# Altium project PROC154E3_SCH.PrjPcb (part 20 of 60)
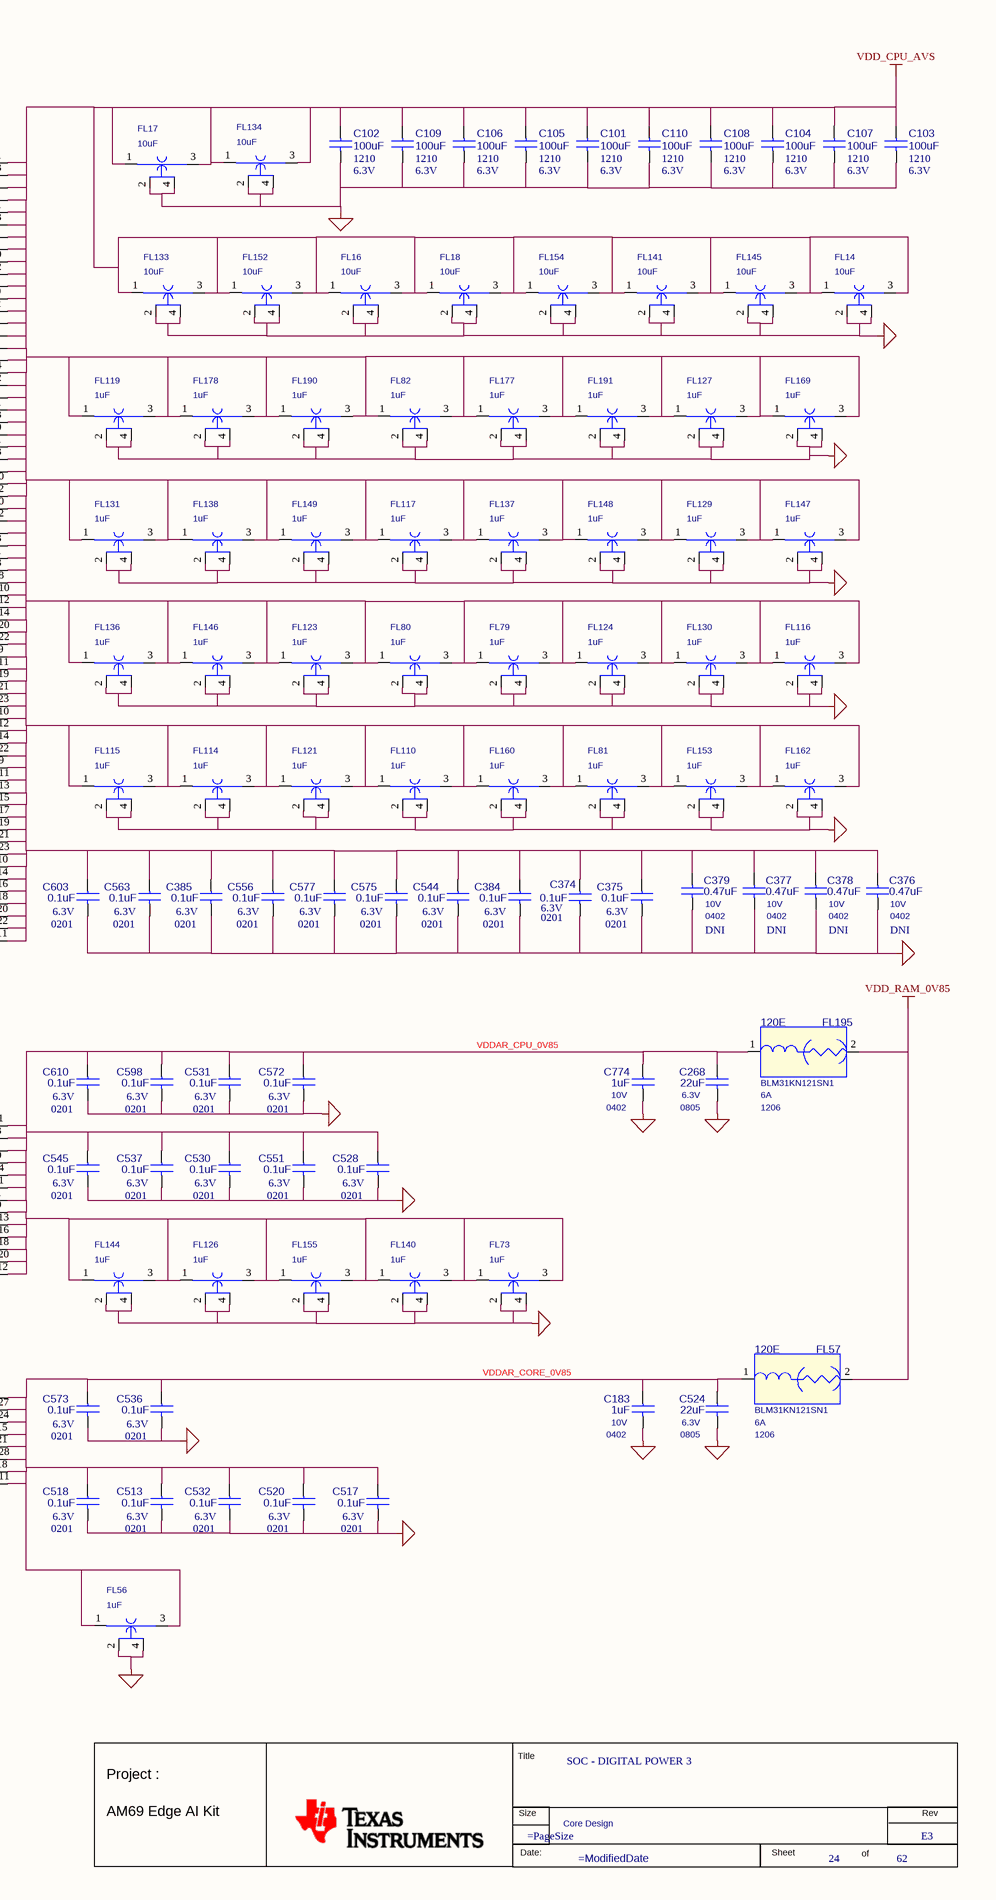
[diagram p107: 24. SOC DIGITAL POWER 3.SchDoc, right]

## Sheet 24. SOC DIGITAL POWER 3.SchDoc: SOC - DIGITAL POWER 3 (continued)
### Library data of the parts
*#24 = MISTRAL_TITLEBLK_CSIZE_1: Issue: 1.0; Project: PROC154E2(001)_SK_AM69; Name: PROC154E2 001 SK AM69; Page Create Date: March  8, 1995; Page Size: =PageSize; Page Modify Date: =ModifiedDate; Schematic Page Count: 62; Schematic Page Number: 24
C97 = CAP_Dup1: CAP CERAMIC 100uF 2.5V 20% X7T 1210; Part Reference: C97; Manufacturer: MURATA; Mistral Part No: 120009080004-R; Mfr_part_number: GCM32ED70E107ME36; Part_type: CAPACITORS\CERAMIC; Direct Alternate_mfr_name: TDK; Direct Alternate_mfr_part_number: CGA6P1X7S1A476M; Project: ALL_DATA_NANO_SOM; Wattage: NA; Customs_HS_Code: 85322990; Custom_Duty: 15%; Value: 100uF; Footprint Ref: CAP1210_2-75; Mfr_name: MURATA; Tolerance: 20%; Distributor_name: DIGIKEY; Distributor_part_number: 490-3390-1-ND; Library Ref: CAP; Height: 2.70MM; Weight: 110mg; Temperature: -55°C+85°C; Datasheet: Y:\MIS_DATABASE\DATASHEETS\CAPACITORS\MURATA-GXX-SER_NOV17.PDF; Crtd /date: MANIRAJA/291216; Chkd/date: VASANTHA/291216; MECHANICAL 3D STEP FILE: CAP1210_2-75; Library Path: Y:\MIS_DATABASE\Library\ALTIUM_TOOL\SCHEMATICS_PARTS\MS_DISCRETE_Library.schlib; Footprint Path: Y:\MIS_DATABASE\Library\ALTIUM_TOOL\PCB_FOOTPRINTS\Altium_Footprint_Lib.PcbLib; Automotive Alternate_mfr_name: TDK; Automotive Alternate_mfr_part_number: CGA6P1X7S1A476M; PCB Footprint: CAP1210_2-75
C99 = CAP_Dup1: CAP CERAMIC 100uF 2.5V 20% X7T 1210; Part Reference: C99; Manufacturer: MURATA; Mistral Part No: 120009080004-R; Mfr_part_number: GCM32ED70E107ME36; Part_type: CAPACITORS\CERAMIC; Direct Alternate_mfr_name: TDK; Direct Alternate_mfr_part_number: CGA6P1X7S1A476M; Project: ALL_DATA_NANO_SOM; Wattage: NA; Customs_HS_Code: 85322990; Custom_Duty: 15%; Value: 100uF; PCB Footprint: CAP1210_2-75; Footprint Ref: CAP1210_2-75; Mfr_name: MURATA; Tolerance: 20%; Distributor_name: DIGIKEY; Distributor_part_number: 490-3390-1-ND; Library Ref: CAP; Height: 2.70MM; Weight: 110mg; Temperature: -55°C+85°C; Datasheet: Y:\MIS_DATABASE\DATASHEETS\CAPACITORS\MURATA-GXX-SER_NOV17.PDF; Crtd /date: MANIRAJA/291216; Chkd/date: VASANTHA/291216; MECHANICAL 3D STEP FILE: CAP1210_2-75; Library Path: Y:\MIS_DATABASE\Library\ALTIUM_TOOL\SCHEMATICS_PARTS\MS_DISCRETE_Library.schlib; Footprint Path: Y:\MIS_DATABASE\Library\ALTIUM_TOOL\PCB_FOOTPRINTS\Altium_Footprint_Lib.PcbLib; Automotive Alternate_mfr_name: TDK; Automotive Alternate_mfr_part_number: CGA6P1X7S1A476M
C101 = CAP_Dup1: CAP CERAMIC 100uF 2.5V 20% X7T 1210; Part Reference: C101; Manufacturer: MURATA; Mistral Part No: 120009080004-R; Mfr_part_number: GCM32ED70E107ME36; Part_type: CAPACITORS\CERAMIC; Direct Alternate_mfr_name: TDK; Direct Alternate_mfr_part_number: CGA6P1X7S1A476M; Project: ALL_DATA_NANO_SOM; Wattage: NA; Customs_HS_Code: 85322990; Custom_Duty: 15%; Value: 100uF; PCB Footprint: CAP1210_2-75; Footprint Ref: CAP1210_2-75; Mfr_name: MURATA; Tolerance: 20%; Distributor_name: DIGIKEY; Distributor_part_number: 490-3390-1-ND; Library Ref: CAP; Height: 2.70MM; Weight: 110mg; Temperature: -55°C+85°C; Datasheet: Y:\MIS_DATABASE\DATASHEETS\CAPACITORS\MURATA-GXX-SER_NOV17.PDF; Crtd /date: MANIRAJA/291216; Chkd/date: VASANTHA/291216; MECHANICAL 3D STEP FILE: CAP1210_2-75; Library Path: Y:\MIS_DATABASE\Library\ALTIUM_TOOL\SCHEMATICS_PARTS\MS_DISCRETE_Library.schlib; Footprint Path: Y:\MIS_DATABASE\Library\ALTIUM_TOOL\PCB_FOOTPRINTS\Altium_Footprint_Lib.PcbLib; Automotive Alternate_mfr_name: TDK; Automotive Alternate_mfr_part_number: CGA6P1X7S1A476M
C102 = CAP_Dup1: CAP CERAMIC 100uF 2.5V 20% X7T 1210; Part Reference: C102; Manufacturer: MURATA; Mistral Part No: 120009080004-R; Mfr_part_number: GCM32ED70E107ME36; Part_type: CAPACITORS\CERAMIC; Direct Alternate_mfr_name: TDK; Direct Alternate_mfr_part_number: CGA6P1X7S1A476M; Project: ALL_DATA_NANO_SOM; Wattage: NA; Customs_HS_Code: 85322990; Custom_Duty: 15%; Value: 100uF; PCB Footprint: CAP1210_2-75; Footprint Ref: CAP1210_2-75; Mfr_name: MURATA; Tolerance: 20%; Distributor_name: DIGIKEY; Distributor_part_number: 490-3390-1-ND; Library Ref: CAP; Height: 2.70MM; Weight: 110mg; Temperature: -55°C+85°C; Datasheet: Y:\MIS_DATABASE\DATASHEETS\CAPACITORS\MURATA-GXX-SER_NOV17.PDF; Crtd /date: MANIRAJA/291216; Chkd/date: VASANTHA/291216; MECHANICAL 3D STEP FILE: CAP1210_2-75; Library Path: Y:\MIS_DATABASE\Library\ALTIUM_TOOL\SCHEMATICS_PARTS\MS_DISCRETE_Library.schlib; Footprint Path: Y:\MIS_DATABASE\Library\ALTIUM_TOOL\PCB_FOOTPRINTS\Altium_Footprint_Lib.PcbLib; Automotive Alternate_mfr_name: TDK; Automotive Alternate_mfr_part_number: CGA6P1X7S1A476M
C103 = CAP_Dup1: CAP CERAMIC 100uF 2.5V 20% X7T 1210; Part Reference: C103; Manufacturer: MURATA; Mistral Part No: 120009080004-R; Mfr_part_number: GCM32ED70E107ME36; Part_type: CAPACITORS\CERAMIC; Direct Alternate_mfr_name: TDK; Direct Alternate_mfr_part_number: CGA6P1X7S1A476M; Project: ALL_DATA_NANO_SOM; Wattage: NA; Customs_HS_Code: 85322990; Custom_Duty: 15%; Value: 100uF; PCB Footprint: CAP1210_2-75; Footprint Ref: CAP1210_2-75; Mfr_name: MURATA; Tolerance: 20%; Distributor_name: DIGIKEY; Distributor_part_number: 490-3390-1-ND; Library Ref: CAP; Height: 2.70MM; Weight: 110mg; Temperature: -55°C+85°C; Datasheet: Y:\MIS_DATABASE\DATASHEETS\CAPACITORS\MURATA-GXX-SER_NOV17.PDF; Crtd /date: MANIRAJA/291216; Chkd/date: VASANTHA/291216; MECHANICAL 3D STEP FILE: CAP1210_2-75; Library Path: Y:\MIS_DATABASE\Library\ALTIUM_TOOL\SCHEMATICS_PARTS\MS_DISCRETE_Library.schlib; Footprint Path: Y:\MIS_DATABASE\Library\ALTIUM_TOOL\PCB_FOOTPRINTS\Altium_Footprint_Lib.PcbLib; Automotive Alternate_mfr_name: TDK; Automotive Alternate_mfr_part_number: CGA6P1X7S1A476M
C104 = CAP_Dup1: CAP CERAMIC 100uF 2.5V 20% X7T 1210; Part Reference: C104; Manufacturer: MURATA; Mistral Part No: 120009080004-R; Mfr_part_number: GCM32ED70E107ME36; Part_type: CAPACITORS\CERAMIC; Direct Alternate_mfr_name: TDK; Direct Alternate_mfr_part_number: CGA6P1X7S1A476M; Project: ALL_DATA_NANO_SOM; Wattage: NA; Customs_HS_Code: 85322990; Custom_Duty: 15%; Value: 100uF; PCB Footprint: CAP1210_2-75; Footprint Ref: CAP1210_2-75; Mfr_name: MURATA; Tolerance: 20%; Distributor_name: DIGIKEY; Distributor_part_number: 490-3390-1-ND; Library Ref: CAP; Height: 2.70MM; Weight: 110mg; Temperature: -55°C+85°C; Datasheet: Y:\MIS_DATABASE\DATASHEETS\CAPACITORS\MURATA-GXX-SER_NOV17.PDF; Crtd /date: MANIRAJA/291216; Chkd/date: VASANTHA/291216; MECHANICAL 3D STEP FILE: CAP1210_2-75; Library Path: Y:\MIS_DATABASE\Library\ALTIUM_TOOL\SCHEMATICS_PARTS\MS_DISCRETE_Library.schlib; Footprint Path: Y:\MIS_DATABASE\Library\ALTIUM_TOOL\PCB_FOOTPRINTS\Altium_Footprint_Lib.PcbLib; Automotive Alternate_mfr_name: TDK; Automotive Alternate_mfr_part_number: CGA6P1X7S1A476M
C105 = CAP_Dup1: CAP CERAMIC 100uF 2.5V 20% X7T 1210; Part Reference: C105; Manufacturer: MURATA; Mistral Part No: 120009080004-R; Mfr_part_number: GCM32ED70E107ME36; Part_type: CAPACITORS\CERAMIC; Direct Alternate_mfr_name: TDK; Direct Alternate_mfr_part_number: CGA6P1X7S1A476M; Project: ALL_DATA_NANO_SOM; Wattage: NA; Customs_HS_Code: 85322990; Custom_Duty: 15%; Value: 100uF; PCB Footprint: CAP1210_2-75; Footprint Ref: CAP1210_2-75; Mfr_name: MURATA; Tolerance: 20%; Distributor_name: DIGIKEY; Distributor_part_number: 490-3390-1-ND; Library Ref: CAP; Height: 2.70MM; Weight: 110mg; Temperature: -55°C+85°C; Datasheet: Y:\MIS_DATABASE\DATASHEETS\CAPACITORS\MURATA-GXX-SER_NOV17.PDF; Crtd /date: MANIRAJA/291216; Chkd/date: VASANTHA/291216; MECHANICAL 3D STEP FILE: CAP1210_2-75; Library Path: Y:\MIS_DATABASE\Library\ALTIUM_TOOL\SCHEMATICS_PARTS\MS_DISCRETE_Library.schlib; Footprint Path: Y:\MIS_DATABASE\Library\ALTIUM_TOOL\PCB_FOOTPRINTS\Altium_Footprint_Lib.PcbLib; Automotive Alternate_mfr_name: TDK; Automotive Alternate_mfr_part_number: CGA6P1X7S1A476M
C106 = CAP_Dup1: CAP CERAMIC 100uF 2.5V 20% X7T 1210; Part Reference: C106; Manufacturer: MURATA; Mistral Part No: 120009080004-R; Mfr_part_number: GCM32ED70E107ME36; Part_type: CAPACITORS\CERAMIC; Direct Alternate_mfr_name: TDK; Direct Alternate_mfr_part_number: CGA6P1X7S1A476M; Project: ALL_DATA_NANO_SOM; Wattage: NA; Customs_HS_Code: 85322990; Custom_Duty: 15%; Value: 100uF; PCB Footprint: CAP1210_2-75; Footprint Ref: CAP1210_2-75; Mfr_name: MURATA; Tolerance: 20%; Distributor_name: DIGIKEY; Distributor_part_number: 490-3390-1-ND; Library Ref: CAP; Height: 2.70MM; Weight: 110mg; Temperature: -55°C+85°C; Datasheet: Y:\MIS_DATABASE\DATASHEETS\CAPACITORS\MURATA-GXX-SER_NOV17.PDF; Crtd /date: MANIRAJA/291216; Chkd/date: VASANTHA/291216; MECHANICAL 3D STEP FILE: CAP1210_2-75; Library Path: Y:\MIS_DATABASE\Library\ALTIUM_TOOL\SCHEMATICS_PARTS\MS_DISCRETE_Library.schlib; Footprint Path: Y:\MIS_DATABASE\Library\ALTIUM_TOOL\PCB_FOOTPRINTS\Altium_Footprint_Lib.PcbLib; Automotive Alternate_mfr_name: TDK; Automotive Alternate_mfr_part_number: CGA6P1X7S1A476M
C107 = CAP_Dup1: CAP CERAMIC 100uF 2.5V 20% X7T 1210; Part Reference: C107; Manufacturer: MURATA; Mistral Part No: 120009080004-R; Mfr_part_number: GCM32ED70E107ME36; Part_type: CAPACITORS\CERAMIC; Direct Alternate_mfr_name: TDK; Direct Alternate_mfr_part_number: CGA6P1X7S1A476M; Project: ALL_DATA_NANO_SOM; Wattage: NA; Customs_HS_Code: 85322990; Custom_Duty: 15%; Value: 100uF; PCB Footprint: CAP1210_2-75; Footprint Ref: CAP1210_2-75; Mfr_name: MURATA; Tolerance: 20%; Distributor_name: DIGIKEY; Distributor_part_number: 490-3390-1-ND; Library Ref: CAP; Height: 2.70MM; Weight: 110mg; Temperature: -55°C+85°C; Datasheet: Y:\MIS_DATABASE\DATASHEETS\CAPACITORS\MURATA-GXX-SER_NOV17.PDF; Crtd /date: MANIRAJA/291216; Chkd/date: VASANTHA/291216; MECHANICAL 3D STEP FILE: CAP1210_2-75; Library Path: Y:\MIS_DATABASE\Library\ALTIUM_TOOL\SCHEMATICS_PARTS\MS_DISCRETE_Library.schlib; Footprint Path: Y:\MIS_DATABASE\Library\ALTIUM_TOOL\PCB_FOOTPRINTS\Altium_Footprint_Lib.PcbLib; Automotive Alternate_mfr_name: TDK; Automotive Alternate_mfr_part_number: CGA6P1X7S1A476M
C108 = CAP_Dup1: CAP CERAMIC 100uF 2.5V 20% X7T 1210; Part Reference: C108; Manufacturer: MURATA; Mistral Part No: 120009080004-R; Mfr_part_number: GCM32ED70E107ME36; Part_type: CAPACITORS\CERAMIC; Direct Alternate_mfr_name: TDK; Direct Alternate_mfr_part_number: CGA6P1X7S1A476M; Project: ALL_DATA_NANO_SOM; Wattage: NA; Customs_HS_Code: 85322990; Custom_Duty: 15%; Value: 100uF; PCB Footprint: CAP1210_2-75; Footprint Ref: CAP1210_2-75; Mfr_name: MURATA; Tolerance: 20%; Distributor_name: DIGIKEY; Distributor_part_number: 490-3390-1-ND; Library Ref: CAP; Height: 2.70MM; Weight: 110mg; Temperature: -55°C+85°C; Datasheet: Y:\MIS_DATABASE\DATASHEETS\CAPACITORS\MURATA-GXX-SER_NOV17.PDF; Crtd /date: MANIRAJA/291216; Chkd/date: VASANTHA/291216; MECHANICAL 3D STEP FILE: CAP1210_2-75; Library Path: Y:\MIS_DATABASE\Library\ALTIUM_TOOL\SCHEMATICS_PARTS\MS_DISCRETE_Library.schlib; Footprint Path: Y:\MIS_DATABASE\Library\ALTIUM_TOOL\PCB_FOOTPRINTS\Altium_Footprint_Lib.PcbLib; Automotive Alternate_mfr_name: TDK; Automotive Alternate_mfr_part_number: CGA6P1X7S1A476M
C109 = CAP_Dup1: CAP CERAMIC 100uF 2.5V 20% X7T 1210; Part Reference: C109; Manufacturer: MURATA; Mistral Part No: 120009080004-R; Mfr_part_number: GCM32ED70E107ME36; Part_type: CAPACITORS\CERAMIC; Direct Alternate_mfr_name: TDK; Direct Alternate_mfr_part_number: CGA6P1X7S1A476M; Project: ALL_DATA_NANO_SOM; Wattage: NA; Customs_HS_Code: 85322990; Custom_Duty: 15%; Value: 100uF; PCB Footprint: CAP1210_2-75; Footprint Ref: CAP1210_2-75; Mfr_name: MURATA; Tolerance: 20%; Distributor_name: DIGIKEY; Distributor_part_number: 490-3390-1-ND; Library Ref: CAP; Height: 2.70MM; Weight: 110mg; Temperature: -55°C+85°C; Datasheet: Y:\MIS_DATABASE\DATASHEETS\CAPACITORS\MURATA-GXX-SER_NOV17.PDF; Crtd /date: MANIRAJA/291216; Chkd/date: VASANTHA/291216; MECHANICAL 3D STEP FILE: CAP1210_2-75; Library Path: Y:\MIS_DATABASE\Library\ALTIUM_TOOL\SCHEMATICS_PARTS\MS_DISCRETE_Library.schlib; Footprint Path: Y:\MIS_DATABASE\Library\ALTIUM_TOOL\PCB_FOOTPRINTS\Altium_Footprint_Lib.PcbLib; Automotive Alternate_mfr_name: TDK; Automotive Alternate_mfr_part_number: CGA6P1X7S1A476M
C110 = CAP_Dup1: CAP CERAMIC 100uF 2.5V 20% X7T 1210; Part Reference: C110; Manufacturer: MURATA; Mistral Part No: 120009080004-R; Mfr_part_number: GCM32ED70E107ME36; Part_type: CAPACITORS\CERAMIC; Direct Alternate_mfr_name: TDK; Direct Alternate_mfr_part_number: CGA6P1X7S1A476M; Project: ALL_DATA_NANO_SOM; Wattage: NA; Customs_HS_Code: 85322990; Custom_Duty: 15%; Value: 100uF; PCB Footprint: CAP1210_2-75; Footprint Ref: CAP1210_2-75; Mfr_name: MURATA; Tolerance: 20%; Distributor_name: DIGIKEY; Distributor_part_number: 490-3390-1-ND; Library Ref: CAP; Height: 2.70MM; Weight: 110mg; Temperature: -55°C+85°C; Datasheet: Y:\MIS_DATABASE\DATASHEETS\CAPACITORS\MURATA-GXX-SER_NOV17.PDF; Crtd /date: MANIRAJA/291216; Chkd/date: VASANTHA/291216; MECHANICAL 3D STEP FILE: CAP1210_2-75; Library Path: Y:\MIS_DATABASE\Library\ALTIUM_TOOL\SCHEMATICS_PARTS\MS_DISCRETE_Library.schlib; Footprint Path: Y:\MIS_DATABASE\Library\ALTIUM_TOOL\PCB_FOOTPRINTS\Altium_Footprint_Lib.PcbLib; Automotive Alternate_mfr_name: TDK; Automotive Alternate_mfr_part_number: CGA6P1X7S1A476M
C114 = CAP_Dup1: CAP CERAMIC 100uF 2.5V 20% X7T 1210; Part Reference: C114; Manufacturer: MURATA; Mistral Part No: 120009080004-R; Mfr_part_number: GCM32ED70E107ME36; Part_type: CAPACITORS\CERAMIC; Direct Alternate_mfr_name: TDK; Direct Alternate_mfr_part_number: CGA6P1X7S1A476M; Project: ALL_DATA_NANO_SOM; Wattage: NA; Customs_HS_Code: 85322990; Custom_Duty: 15%; Value: 100uF; PCB Footprint: CAP1210_2-75; Footprint Ref: CAP1210_2-75; Mfr_name: MURATA; Tolerance: 20%; Distributor_name: DIGIKEY; Distributor_part_number: 490-3390-1-ND; Library Ref: CAP; Height: 2.70MM; Weight: 110mg; Temperature: -55°C+85°C; Datasheet: Y:\MIS_DATABASE\DATASHEETS\CAPACITORS\MURATA-GXX-SER_NOV17.PDF; Crtd /date: MANIRAJA/291216; Chkd/date: VASANTHA/291216; MECHANICAL 3D STEP FILE: CAP1210_2-75; Library Path: Y:\MIS_DATABASE\Library\ALTIUM_TOOL\SCHEMATICS_PARTS\MS_DISCRETE_Library.schlib; Footprint Path: Y:\MIS_DATABASE\Library\ALTIUM_TOOL\PCB_FOOTPRINTS\Altium_Footprint_Lib.PcbLib; Automotive Alternate_mfr_name: TDK; Automotive Alternate_mfr_part_number: CGA6P1X7S1A476M
C132 = CAP_Dup1: CAP CERAMIC 100uF 2.5V 20% X7T 1210; Part Reference: C132; Manufacturer: MURATA; Mistral Part No: 120009080004-R; Mfr_part_number: GCM32ED70E107ME36; Part_type: CAPACITORS\CERAMIC; Direct Alternate_mfr_name: TDK; Direct Alternate_mfr_part_number: CGA6P1X7S1A476M; Project: ALL_DATA_NANO_SOM; Wattage: NA; Customs_HS_Code: 85322990; Custom_Duty: 15%; Value: 100uF; PCB Footprint: CAP1210_2-75; Footprint Ref: CAP1210_2-75; Mfr_name: MURATA; Tolerance: 20%; Distributor_name: DIGIKEY; Distributor_part_number: 490-3390-1-ND; Library Ref: CAP; Height: 2.70MM; Weight: 110mg; Temperature: -55°C+85°C; Datasheet: Y:\MIS_DATABASE\DATASHEETS\CAPACITORS\MURATA-GXX-SER_NOV17.PDF; Crtd /date: MANIRAJA/291216; Chkd/date: VASANTHA/291216; MECHANICAL 3D STEP FILE: CAP1210_2-75; Library Path: Y:\MIS_DATABASE\Library\ALTIUM_TOOL\SCHEMATICS_PARTS\MS_DISCRETE_Library.schlib; Footprint Path: Y:\MIS_DATABASE\Library\ALTIUM_TOOL\PCB_FOOTPRINTS\Altium_Footprint_Lib.PcbLib; Automotive Alternate_mfr_name: TDK; Automotive Alternate_mfr_part_number: CGA6P1X7S1A476M
C145 = CAP_Dup1: CAP CERAMIC 100uF 2.5V 20% X7T 1210; Part Reference: C145; Manufacturer: MURATA; Mistral Part No: 120009080004-R; Mfr_part_number: GCM32ED70E107ME36; Part_type: CAPACITORS\CERAMIC; Direct Alternate_mfr_name: TDK; Direct Alternate_mfr_part_number: CGA6P1X7S1A476M; Project: ALL_DATA_NANO_SOM; Wattage: NA; Customs_HS_Code: 85322990; Custom_Duty: 15%; Value: 100uF; PCB Footprint: CAP1210_2-75; Footprint Ref: CAP1210_2-75; Mfr_name: MURATA; Tolerance: 20%; Distributor_name: DIGIKEY; Distributor_part_number: 490-3390-1-ND; Library Ref: CAP; Height: 2.70MM; Weight: 110mg; Temperature: -55°C+85°C; Datasheet: Y:\MIS_DATABASE\DATASHEETS\CAPACITORS\MURATA-GXX-SER_NOV17.PDF; Crtd /date: MANIRAJA/291216; Chkd/date: VASANTHA/291216; MECHANICAL 3D STEP FILE: CAP1210_2-75; Library Path: Y:\MIS_DATABASE\Library\ALTIUM_TOOL\SCHEMATICS_PARTS\MS_DISCRETE_Library.schlib; Footprint Path: Y:\MIS_DATABASE\Library\ALTIUM_TOOL\PCB_FOOTPRINTS\Altium_Footprint_Lib.PcbLib; Automotive Alternate_mfr_name: TDK; Automotive Alternate_mfr_part_number: CGA6P1X7S1A476M
C151 = CAP_Dup1: CAP CERAMIC 100uF 2.5V 20% X7T 1210; Part Reference: C151; Automotive Alternate_mfr_part_number: CGA6P1X7S1A476M; Automotive Alternate_mfr_name: TDK; Part_type: CAPACITORS\CERAMIC; Mfr_part_number: GCM32ED70E107ME36; Mfr_name: MURATA; Mistral Part No: 120009080004-R; Custom_Duty: 15%; Customs_HS_Code: 85322990; Wattage: NA; Project: ALL_DATA_NANO_SOM; Value: 100uF; Direct Alternate_mfr_part_number: CGA6P1X7S1A476M; Direct Alternate_mfr_name: TDK; Footprint Path: Y:\MIS_DATABASE\Library\ALTIUM_TOOL\PCB_FOOTPRINTS\Altium_Footprint_Lib.PcbLib; Library Path: Y:\MIS_DATABASE\Library\ALTIUM_TOOL\SCHEMATICS_PARTS\MS_DISCRETE_Library.schlib; MECHANICAL 3D STEP FILE: CAP1210_2-75; Chkd/date: VASANTHA/291216; Crtd /date: MANIRAJA/291216; Datasheet: Y:\MIS_DATABASE\DATASHEETS\CAPACITORS\MURATA-GXX-SER_NOV17.PDF; Temperature: -55°C+85°C; Weight: 110mg; Height: 2.70MM; Library Ref: CAP; Distributor_part_number: 490-3390-1-ND; Distributor_name: DIGIKEY; Tolerance: 20%; Footprint Ref: CAP1210_2-75; Manufacturer: MURATA; PCB Footprint: CAP1210_2-75
C170 = CAP_Dup1: CAP CERAMIC 0.1uF 6.3V 10% X7S AUTO 0201; Part Reference: C170; Manufacturer: MURATA; Part_type: CAPACITORS\CERAMIC; Mfr_part_number: GCM033C70J104KE02D; Mistral Part No: 120018100001-R; Custom_Duty: 15%; Customs_HS_Code: 85322990; Wattage: NA; Project: TI_J7_SVB-DUT; Value: 0.1uF; PCB Footprint: CAP0201_0-5; Footprint Path: Y:\MIS_DATABASE\Library\ALTIUM_TOOL\PCB_FOOTPRINTS\Altium_Footprint_Lib.PcbLib; Library Path: Y:\MIS_DATABASE\Library\ALTIUM_TOOL\SCHEMATICS_PARTS\MS_DISCRETE_Library.schlib; MECHANICAL 3D STEP FILE: CAP0201_0-5; Chkd/date: MANIRAJA/011018; Crtd /date: MANIRAJA/011018; Datasheet: Y:\MIS_DATABASE\DATASHEETS\CAPACITORS\MURATA-GCM-SER.PDF; Temperature: -55°C+125°C; Weight: NA; Height: 0.33MM; Library Ref: CAP; Distributor_part_number: NA; Distributor_name: NA; Tolerance: 10%; Mfr_name: MURATA; Footprint Ref: CAP0201_0-5
C171 = CAP_Dup1: CAP CERAMIC 0.1uF 6.3V 10% X7S AUTO 0201; Part Reference: C171; Manufacturer: MURATA; Mistral Part No: 120018100001-R; Mfr_part_number: GCM033C70J104KE02D; Part_type: CAPACITORS\CERAMIC; Project: TI_J7_SVB-DUT; Wattage: NA; Customs_HS_Code: 85322990; Custom_Duty: 15%; Value: 0.1uF; PCB Footprint: CAP0201_0-5; Footprint Ref: CAP0201_0-5; Mfr_name: MURATA; Tolerance: 10%; Distributor_name: NA; Distributor_part_number: NA; Library Ref: CAP; Height: 0.33MM; Weight: NA; Temperature: -55°C+125°C; Datasheet: Y:\MIS_DATABASE\DATASHEETS\CAPACITORS\MURATA-GCM-SER.PDF; Crtd /date: MANIRAJA/011018; Chkd/date: MANIRAJA/011018; MECHANICAL 3D STEP FILE: CAP0201_0-5; Library Path: Y:\MIS_DATABASE\Library\ALTIUM_TOOL\SCHEMATICS_PARTS\MS_DISCRETE_Library.schlib; Footprint Path: Y:\MIS_DATABASE\Library\ALTIUM_TOOL\PCB_FOOTPRINTS\Altium_Footprint_Lib.PcbLib
C183 = CAP_Dup1: CAP CERAMIC 1uF 10V 10% X7S AUTO 0402; Part Reference: C183; Manufacturer: MURATA; Part_type: CAPACITORS\CERAMIC; Mfr_part_number: GCM155C71A105KE38D; Mistral Part No: 120018090021-R; Custom_Duty: 15%; Customs_HS_Code: 85322990; Wattage: NA; Project: SMART-M_SCRIPTALK_PB; Value: 1uF; PCB Footprint: CAP0402_0-75; Footprint Path: Y:\MIS_DATABASE\Library\ALTIUM_TOOL\PCB_FOOTPRINTS\Altium_Footprint_Lib.PcbLib; Library Path: Y:\MIS_DATABASE\Library\ALTIUM_TOOL\SCHEMATICS_PARTS\MS_DISCRETE_Library.schlib; MECHANICAL 3D STEP FILE: CAP0402_0-75; Chkd/date: MANIRAJA/100918; Crtd /date: ALVY/100918; Datasheet: Y:\MIS_DATABASE\DATASHEETS\CAPACITORS\MURATA-GCM-SER.PDF; Temperature: -55°C+125°C; Weight: 6mg; Height: 0.70MM; Library Ref: CAP; Distributor_part_number: 490-13409-1-ND; Distributor_name: DIGIKEY; Tolerance: 10%; Mfr_name: MURATA; Footprint Ref: CAP0402_0-75
C268 = CAP_Dup1: CAP CERAMIC 22uF 6.3V 20% X7T AUTO 0805; Part Reference: C268; Manufacturer: MURATA; Part_type: CAPACITORS\CERAMIC; Mfr_part_number: GCM21BD70J226ME36L; Mistral Part No: 120018100065-R; Automotive Alternate_mfr_name: TDK; Automotive Alternate_mfr_part_number: CGA4J1X7T0J226M; Custom_Duty: 15%; Customs_HS_Code: 85322990; Wattage: NA; Project: TI_J7ES_EVM_SOM; Value: 22uF; PCB Footprint: CAP0805_1-25; Footprint Path: Y:\MIS_DATABASE\Library\ALTIUM_TOOL\PCB_FOOTPRINTS\Altium_Footprint_Lib.PcbLib; Library Path: Y:\MIS_DATABASE\Library\ALTIUM_TOOL\SCHEMATICS_PARTS\MS_DISCRETE_Library.schlib; MECHANICAL 3D STEP FILE: CAP0805_1-25; Chkd/date: MANIRAJA/261018; Crtd /date: ALVY/251018; Datasheet: Y:\MIS_DATABASE\DATASHEETS\CAPACITORS\GCM-SERIES.PDF; Temperature: -55°C+125°C; Weight: NA; Height: 1.25MM; Library Ref: CAP; Distributor_part_number: 81-GCM21BD70J226ME6L; Distributor_name: MOUSER; Tolerance: 20%; Mfr_name: MURATA; Footprint Ref: CAP0805_1-25
C374 = CAP_Dup1: CAP CERAMIC 0.1uF 6.3V 10% X7S AUTO 0201; Part Reference: C374; Manufacturer: MURATA; Mistral Part No: 120018100001-R; Mfr_part_number: GCM033C70J104KE02D; Part_type: CAPACITORS\CERAMIC; Project: TI_J7_SVB-DUT; Wattage: NA; Customs_HS_Code: 85322990; Custom_Duty: 15%; Value: 0.1uF; Footprint Ref: CAP0201_0-5; Mfr_name: MURATA; Tolerance: 10%; Distributor_name: NA; Distributor_part_number: NA; Library Ref: CAP; Height: 0.33MM; Weight: NA; Temperature: -55°C+125°C; Datasheet: Y:\MIS_DATABASE\DATASHEETS\CAPACITORS\MURATA-GCM-SER.PDF; Crtd /date: MANIRAJA/011018; Chkd/date: MANIRAJA/011018; MECHANICAL 3D STEP FILE: CAP0201_0-5; Library Path: Y:\MIS_DATABASE\Library\ALTIUM_TOOL\SCHEMATICS_PARTS\MS_DISCRETE_Library.schlib; Footprint Path: Y:\MIS_DATABASE\Library\ALTIUM_TOOL\PCB_FOOTPRINTS\Altium_Footprint_Lib.PcbLib; PCB Footprint: CAP0201_0-5
C375 = CAP_Dup1: CAP CERAMIC 0.1uF 6.3V 10% X7S AUTO 0201; Part Reference: C375; Manufacturer: MURATA; Mistral Part No: 120018100001-R; Mfr_part_number: GCM033C70J104KE02D; Part_type: CAPACITORS\CERAMIC; Project: TI_J7_SVB-DUT; Wattage: NA; Customs_HS_Code: 85322990; Custom_Duty: 15%; Value: 0.1uF; PCB Footprint: CAP0201_0-5; Footprint Ref: CAP0201_0-5; Mfr_name: MURATA; Tolerance: 10%; Distributor_name: NA; Distributor_part_number: NA; Library Ref: CAP; Height: 0.33MM; Weight: NA; Temperature: -55°C+125°C; Datasheet: Y:\MIS_DATABASE\DATASHEETS\CAPACITORS\MURATA-GCM-SER.PDF; Crtd /date: MANIRAJA/011018; Chkd/date: MANIRAJA/011018; MECHANICAL 3D STEP FILE: CAP0201_0-5; Library Path: Y:\MIS_DATABASE\Library\ALTIUM_TOOL\SCHEMATICS_PARTS\MS_DISCRETE_Library.schlib; Footprint Path: Y:\MIS_DATABASE\Library\ALTIUM_TOOL\PCB_FOOTPRINTS\Altium_Footprint_Lib.PcbLib
C376 = CAP_Dup1: CAP CERAMIC 0.47uF 10V 10% X7S AUTO 0402; Part Reference: C376; Manufacturer: MURATA; Automotive Alternate_mfr_part_number: CGA2B3X7S1A474K050BB; Automotive Alternate_mfr_name: TDK; Part_type: CAPACITORS\CERAMIC; Mfr_part_number: GCM155C71A474KE36D; Mistral Part No: 120018090057-R; Custom_Duty: 15%; Customs_HS_Code: 85322990; Wattage: NA; Project: TI_J7_SVB-DUT; Value: 0.47uF; PCB Footprint: CAP0402_0-75; Direct Alternate_mfr_part_number: CGA2B3X7S1A474K050BB; Direct Alternate_mfr_name: TDK; Footprint Path: Y:\MIS_DATABASE\Library\ALTIUM_TOOL\PCB_FOOTPRINTS\Altium_Footprint_Lib.PcbLib; Library Path: Y:\MIS_DATABASE\Library\ALTIUM_TOOL\SCHEMATICS_PARTS\MS_DISCRETE_Library.schlib; MECHANICAL 3D STEP FILE: CAP0402_0-75; Chkd/date: MANIRAJA/280918; Crtd /date: ALVY/280918; Datasheet: Y:\MIS_DATABASE\DATASHEETS\CAPACITORS\GCM155C71A474KE36D.PDF; Temperature: -55°C+125°C; Weight: 6mg; Height: 0.60MM; Library Ref: CAP; Distributor_part_number: 490-14427-1-ND; Distributor_name: DIGIKEY; Tolerance: 10%; Mfr_name: MURATA; Footprint Ref: CAP0402_0-75
C377 = CAP_Dup1: CAP CERAMIC 0.47uF 10V 10% X7S AUTO 0402; Part Reference: C377; Manufacturer: MURATA; Automotive Alternate_mfr_part_number: CGA2B3X7S1A474K050BB; Automotive Alternate_mfr_name: TDK; Mistral Part No: 120018090057-R; Mfr_part_number: GCM155C71A474KE36D; Part_type: CAPACITORS\CERAMIC; Project: TI_J7_SVB-DUT; Wattage: NA; Customs_HS_Code: 85322990; Custom_Duty: 15%; Value: 0.47uF; PCB Footprint: CAP0402_0-75; Direct Alternate_mfr_part_number: CGA2B3X7S1A474K050BB; Direct Alternate_mfr_name: TDK; Footprint Ref: CAP0402_0-75; Mfr_name: MURATA; Tolerance: 10%; Distributor_name: DIGIKEY; Distributor_part_number: 490-14427-1-ND; Library Ref: CAP; Height: 0.60MM; Weight: 6mg; Temperature: -55°C+125°C; Datasheet: Y:\MIS_DATABASE\DATASHEETS\CAPACITORS\GCM155C71A474KE36D.PDF; Crtd /date: ALVY/280918; Chkd/date: MANIRAJA/280918; MECHANICAL 3D STEP FILE: CAP0402_0-75; Library Path: Y:\MIS_DATABASE\Library\ALTIUM_TOOL\SCHEMATICS_PARTS\MS_DISCRETE_Library.schlib; Footprint Path: Y:\MIS_DATABASE\Library\ALTIUM_TOOL\PCB_FOOTPRINTS\Altium_Footprint_Lib.PcbLib
C378 = CAP_Dup1: CAP CERAMIC 0.47uF 10V 10% X7S AUTO 0402; Part Reference: C378; Manufacturer: MURATA; Automotive Alternate_mfr_part_number: CGA2B3X7S1A474K050BB; Automotive Alternate_mfr_name: TDK; Part_type: CAPACITORS\CERAMIC; Mfr_part_number: GCM155C71A474KE36D; Mistral Part No: 120018090057-R; Custom_Duty: 15%; Customs_HS_Code: 85322990; Wattage: NA; Project: TI_J7_SVB-DUT; Value: 0.47uF; PCB Footprint: CAP0402_0-75; Direct Alternate_mfr_part_number: CGA2B3X7S1A474K050BB; Direct Alternate_mfr_name: TDK; Footprint Path: Y:\MIS_DATABASE\Library\ALTIUM_TOOL\PCB_FOOTPRINTS\Altium_Footprint_Lib.PcbLib; Library Path: Y:\MIS_DATABASE\Library\ALTIUM_TOOL\SCHEMATICS_PARTS\MS_DISCRETE_Library.schlib; MECHANICAL 3D STEP FILE: CAP0402_0-75; Chkd/date: MANIRAJA/280918; Crtd /date: ALVY/280918; Datasheet: Y:\MIS_DATABASE\DATASHEETS\CAPACITORS\GCM155C71A474KE36D.PDF; Temperature: -55°C+125°C; Weight: 6mg; Height: 0.60MM; Library Ref: CAP; Distributor_part_number: 490-14427-1-ND; Distributor_name: DIGIKEY; Tolerance: 10%; Mfr_name: MURATA; Footprint Ref: CAP0402_0-75
C379 = CAP_Dup1: CAP CERAMIC 0.47uF 10V 10% X7S AUTO 0402; Part Reference: C379; Manufacturer: MURATA; Automotive Alternate_mfr_part_number: CGA2B3X7S1A474K050BB; Automotive Alternate_mfr_name: TDK; Part_type: CAPACITORS\CERAMIC; Mfr_part_number: GCM155C71A474KE36D; Mistral Part No: 120018090057-R; Custom_Duty: 15%; Customs_HS_Code: 85322990; Wattage: NA; Project: TI_J7_SVB-DUT; Value: 0.47uF; PCB Footprint: CAP0402_0-75; Direct Alternate_mfr_part_number: CGA2B3X7S1A474K050BB; Direct Alternate_mfr_name: TDK; Footprint Path: Y:\MIS_DATABASE\Library\ALTIUM_TOOL\PCB_FOOTPRINTS\Altium_Footprint_Lib.PcbLib; Library Path: Y:\MIS_DATABASE\Library\ALTIUM_TOOL\SCHEMATICS_PARTS\MS_DISCRETE_Library.schlib; MECHANICAL 3D STEP FILE: CAP0402_0-75; Chkd/date: MANIRAJA/280918; Crtd /date: ALVY/280918; Datasheet: Y:\MIS_DATABASE\DATASHEETS\CAPACITORS\GCM155C71A474KE36D.PDF; Temperature: -55°C+125°C; Weight: 6mg; Height: 0.60MM; Library Ref: CAP; Distributor_part_number: 490-14427-1-ND; Distributor_name: DIGIKEY; Tolerance: 10%; Mfr_name: MURATA; Footprint Ref: CAP0402_0-75
C384 = CAP_Dup1: CAP CERAMIC 0.1uF 6.3V 10% X7S AUTO 0201; Part Reference: C384; Manufacturer: MURATA; Part_type: CAPACITORS\CERAMIC; Mfr_part_number: GCM033C70J104KE02D; Mistral Part No: 120018100001-R; Custom_Duty: 15%; Customs_HS_Code: 85322990; Wattage: NA; Project: TI_J7_SVB-DUT; Value: 0.1uF; PCB Footprint: CAP0201_0-5; Footprint Path: Y:\MIS_DATABASE\Library\ALTIUM_TOOL\PCB_FOOTPRINTS\Altium_Footprint_Lib.PcbLib; Library Path: Y:\MIS_DATABASE\Library\ALTIUM_TOOL\SCHEMATICS_PARTS\MS_DISCRETE_Library.schlib; MECHANICAL 3D STEP FILE: CAP0201_0-5; Chkd/date: MANIRAJA/011018; Crtd /date: MANIRAJA/011018; Datasheet: Y:\MIS_DATABASE\DATASHEETS\CAPACITORS\MURATA-GCM-SER.PDF; Temperature: -55°C+125°C; Weight: NA; Height: 0.33MM; Library Ref: CAP; Distributor_part_number: NA; Distributor_name: NA; Tolerance: 10%; Mfr_name: MURATA; Footprint Ref: CAP0201_0-5
C385 = CAP_Dup1: CAP CERAMIC 0.1uF 6.3V 10% X7S AUTO 0201; Part Reference: C385; Manufacturer: MURATA; Mistral Part No: 120018100001-R; Mfr_part_number: GCM033C70J104KE02D; Part_type: CAPACITORS\CERAMIC; Project: TI_J7_SVB-DUT; Wattage: NA; Customs_HS_Code: 85322990; Custom_Duty: 15%; Value: 0.1uF; PCB Footprint: CAP0201_0-5; Footprint Ref: CAP0201_0-5; Mfr_name: MURATA; Tolerance: 10%; Distributor_name: NA; Distributor_part_number: NA; Library Ref: CAP; Height: 0.33MM; Weight: NA; Temperature: -55°C+125°C; Datasheet: Y:\MIS_DATABASE\DATASHEETS\CAPACITORS\MURATA-GCM-SER.PDF; Crtd /date: MANIRAJA/011018; Chkd/date: MANIRAJA/011018; MECHANICAL 3D STEP FILE: CAP0201_0-5; Library Path: Y:\MIS_DATABASE\Library\ALTIUM_TOOL\SCHEMATICS_PARTS\MS_DISCRETE_Library.schlib; Footprint Path: Y:\MIS_DATABASE\Library\ALTIUM_TOOL\PCB_FOOTPRINTS\Altium_Footprint_Lib.PcbLib
C432 = CAP_Dup1: CAP CERAMIC 0.47uF 10V 10% X7S AUTO 0402; Part Reference: C432; Manufacturer: MURATA; Mistral Part No: 120018090057-R; Mfr_part_number: GCM155C71A474KE36D; Part_type: CAPACITORS\CERAMIC; Direct Alternate_mfr_name: TDK; Direct Alternate_mfr_part_number: CGA2B3X7S1A474K050BB; Project: TI_J7_SVB-DUT; Wattage: NA; Customs_HS_Code: 85322990; Custom_Duty: 15%; Value: 0.47uF; PCB Footprint: CAP0402_0-75; Footprint Ref: CAP0402_0-75; Mfr_name: MURATA; Tolerance: 10%; Distributor_name: DIGIKEY; Distributor_part_number: 490-14427-1-ND; Library Ref: CAP; Height: 0.60MM; Weight: 6mg; Temperature: -55°C+125°C; Datasheet: Y:\MIS_DATABASE\DATASHEETS\CAPACITORS\GCM155C71A474KE36D.PDF; Crtd /date: ALVY/280918; Chkd/date: MANIRAJA/280918; MECHANICAL 3D STEP FILE: CAP0402_0-75; Library Path: Y:\MIS_DATABASE\Library\ALTIUM_TOOL\SCHEMATICS_PARTS\MS_DISCRETE_Library.schlib; Footprint Path: Y:\MIS_DATABASE\Library\ALTIUM_TOOL\PCB_FOOTPRINTS\Altium_Footprint_Lib.PcbLib; Automotive Alternate_mfr_name: TDK; Automotive Alternate_mfr_part_number: CGA2B3X7S1A474K050BB
C433 = CAP_Dup1: CAP CERAMIC 0.47uF 10V 10% X7S AUTO 0402; Part Reference: C433; Manufacturer: MURATA; Mistral Part No: 120018090057-R; Mfr_part_number: GCM155C71A474KE36D; Part_type: CAPACITORS\CERAMIC; Direct Alternate_mfr_name: TDK; Direct Alternate_mfr_part_number: CGA2B3X7S1A474K050BB; Project: TI_J7_SVB-DUT; Wattage: NA; Customs_HS_Code: 85322990; Custom_Duty: 15%; Value: 0.47uF; PCB Footprint: CAP0402_0-75; Footprint Ref: CAP0402_0-75; Mfr_name: MURATA; Tolerance: 10%; Distributor_name: DIGIKEY; Distributor_part_number: 490-14427-1-ND; Library Ref: CAP; Height: 0.60MM; Weight: 6mg; Temperature: -55°C+125°C; Datasheet: Y:\MIS_DATABASE\DATASHEETS\CAPACITORS\GCM155C71A474KE36D.PDF; Crtd /date: ALVY/280918; Chkd/date: MANIRAJA/280918; MECHANICAL 3D STEP FILE: CAP0402_0-75; Library Path: Y:\MIS_DATABASE\Library\ALTIUM_TOOL\SCHEMATICS_PARTS\MS_DISCRETE_Library.schlib; Footprint Path: Y:\MIS_DATABASE\Library\ALTIUM_TOOL\PCB_FOOTPRINTS\Altium_Footprint_Lib.PcbLib; Automotive Alternate_mfr_name: TDK; Automotive Alternate_mfr_part_number: CGA2B3X7S1A474K050BB
C434 = CAP_Dup1: CAP CERAMIC 0.47uF 10V 10% X7S AUTO 0402; Part Reference: C434; Manufacturer: MURATA; Mistral Part No: 120018090057-R; Mfr_part_number: GCM155C71A474KE36D; Part_type: CAPACITORS\CERAMIC; Direct Alternate_mfr_name: TDK; Direct Alternate_mfr_part_number: CGA2B3X7S1A474K050BB; Project: TI_J7_SVB-DUT; Wattage: NA; Customs_HS_Code: 85322990; Custom_Duty: 15%; Value: 0.47uF; PCB Footprint: CAP0402_0-75; Footprint Ref: CAP0402_0-75; Mfr_name: MURATA; Tolerance: 10%; Distributor_name: DIGIKEY; Distributor_part_number: 490-14427-1-ND; Library Ref: CAP; Height: 0.60MM; Weight: 6mg; Temperature: -55°C+125°C; Datasheet: Y:\MIS_DATABASE\DATASHEETS\CAPACITORS\GCM155C71A474KE36D.PDF; Crtd /date: ALVY/280918; Chkd/date: MANIRAJA/280918; MECHANICAL 3D STEP FILE: CAP0402_0-75; Library Path: Y:\MIS_DATABASE\Library\ALTIUM_TOOL\SCHEMATICS_PARTS\MS_DISCRETE_Library.schlib; Footprint Path: Y:\MIS_DATABASE\Library\ALTIUM_TOOL\PCB_FOOTPRINTS\Altium_Footprint_Lib.PcbLib; Automotive Alternate_mfr_name: TDK; Automotive Alternate_mfr_part_number: CGA2B3X7S1A474K050BB
C435 = CAP_Dup1: CAP CERAMIC 0.47uF 10V 10% X7S AUTO 0402; Part Reference: C435; Manufacturer: MURATA; Part_type: CAPACITORS\CERAMIC; Mfr_part_number: GCM155C71A474KE36D; Mistral Part No: 120018090057-R; Direct Alternate_mfr_name: TDK; Direct Alternate_mfr_part_number: CGA2B3X7S1A474K050BB; Custom_Duty: 15%; Customs_HS_Code: 85322990; Wattage: NA; Project: TI_J7_SVB-DUT; Value: 0.47uF; PCB Footprint: CAP0402_0-75; Footprint Path: Y:\MIS_DATABASE\Library\ALTIUM_TOOL\PCB_FOOTPRINTS\Altium_Footprint_Lib.PcbLib; Library Path: Y:\MIS_DATABASE\Library\ALTIUM_TOOL\SCHEMATICS_PARTS\MS_DISCRETE_Library.schlib; MECHANICAL 3D STEP FILE: CAP0402_0-75; Chkd/date: MANIRAJA/280918; Crtd /date: ALVY/280918; Datasheet: Y:\MIS_DATABASE\DATASHEETS\CAPACITORS\GCM155C71A474KE36D.PDF; Temperature: -55°C+125°C; Weight: 6mg; Height: 0.60MM; Library Ref: CAP; Distributor_part_number: 490-14427-1-ND; Distributor_name: DIGIKEY; Tolerance: 10%; Mfr_name: MURATA; Footprint Ref: CAP0402_0-75; Automotive Alternate_mfr_name: TDK; Automotive Alternate_mfr_part_number: CGA2B3X7S1A474K050BB
C512 = CAP_Dup1: CAP CERAMIC 0.1uF 6.3V 10% X7S AUTO 0201; Part Reference: C512; Manufacturer: MURATA; Part_type: CAPACITORS\CERAMIC; Mfr_part_number: GCM033C70J104KE02D; Mistral Part No: 120018100001-R; Custom_Duty: 15%; Customs_HS_Code: 85322990; Wattage: NA; Project: TI_J7_SVB-DUT; Value: 0.1uF; PCB Footprint: CAP0201_0-5; Footprint Path: Y:\MIS_DATABASE\Library\ALTIUM_TOOL\PCB_FOOTPRINTS\Altium_Footprint_Lib.PcbLib; Library Path: Y:\MIS_DATABASE\Library\ALTIUM_TOOL\SCHEMATICS_PARTS\MS_DISCRETE_Library.schlib; MECHANICAL 3D STEP FILE: CAP0201_0-5; Chkd/date: MANIRAJA/011018; Crtd /date: MANIRAJA/011018; Datasheet: Y:\MIS_DATABASE\DATASHEETS\CAPACITORS\MURATA-GCM-SER.PDF; Temperature: -55°C+125°C; Weight: NA; Height: 0.33MM; Library Ref: CAP; Distributor_part_number: NA; Distributor_name: NA; Tolerance: 10%; Mfr_name: MURATA; Footprint Ref: CAP0201_0-5
C513 = CAP_Dup1: CAP CERAMIC 0.1uF 6.3V 10% X7S AUTO 0201; Part Reference: C513; Manufacturer: MURATA; Part_type: CAPACITORS\CERAMIC; Mfr_part_number: GCM033C70J104KE02D; Mistral Part No: 120018100001-R; Custom_Duty: 15%; Customs_HS_Code: 85322990; Wattage: NA; Project: TI_J7_SVB-DUT; Value: 0.1uF; PCB Footprint: CAP0201_0-5; Footprint Path: Y:\MIS_DATABASE\Library\ALTIUM_TOOL\PCB_FOOTPRINTS\Altium_Footprint_Lib.PcbLib; Library Path: Y:\MIS_DATABASE\Library\ALTIUM_TOOL\SCHEMATICS_PARTS\MS_DISCRETE_Library.schlib; MECHANICAL 3D STEP FILE: CAP0201_0-5; Chkd/date: MANIRAJA/011018; Crtd /date: MANIRAJA/011018; Datasheet: Y:\MIS_DATABASE\DATASHEETS\CAPACITORS\MURATA-GCM-SER.PDF; Temperature: -55°C+125°C; Weight: NA; Height: 0.33MM; Library Ref: CAP; Distributor_part_number: NA; Distributor_name: NA; Tolerance: 10%; Mfr_name: MURATA; Footprint Ref: CAP0201_0-5
C514 = CAP_Dup1: CAP CERAMIC 0.1uF 6.3V 10% X7S AUTO 0201; Part Reference: C514; Manufacturer: MURATA; Mistral Part No: 120018100001-R; Mfr_part_number: GCM033C70J104KE02D; Part_type: CAPACITORS\CERAMIC; Project: TI_J7_SVB-DUT; Wattage: NA; Customs_HS_Code: 85322990; Custom_Duty: 15%; Value: 0.1uF; PCB Footprint: CAP0201_0-5; Footprint Ref: CAP0201_0-5; Mfr_name: MURATA; Tolerance: 10%; Distributor_name: NA; Distributor_part_number: NA; Library Ref: CAP; Height: 0.33MM; Weight: NA; Temperature: -55°C+125°C; Datasheet: Y:\MIS_DATABASE\DATASHEETS\CAPACITORS\MURATA-GCM-SER.PDF; Crtd /date: MANIRAJA/011018; Chkd/date: MANIRAJA/011018; MECHANICAL 3D STEP FILE: CAP0201_0-5; Library Path: Y:\MIS_DATABASE\Library\ALTIUM_TOOL\SCHEMATICS_PARTS\MS_DISCRETE_Library.schlib; Footprint Path: Y:\MIS_DATABASE\Library\ALTIUM_TOOL\PCB_FOOTPRINTS\Altium_Footprint_Lib.PcbLib
C517 = CAP_Dup1: CAP CERAMIC 0.1uF 6.3V 10% X7S AUTO 0201; Part Reference: C517; Manufacturer: MURATA; Part_type: CAPACITORS\CERAMIC; Mfr_part_number: GCM033C70J104KE02D; Mistral Part No: 120018100001-R; Custom_Duty: 15%; Customs_HS_Code: 85322990; Wattage: NA; Project: TI_J7_SVB-DUT; Value: 0.1uF; PCB Footprint: CAP0201_0-5; Footprint Path: Y:\MIS_DATABASE\Library\ALTIUM_TOOL\PCB_FOOTPRINTS\Altium_Footprint_Lib.PcbLib; Library Path: Y:\MIS_DATABASE\Library\ALTIUM_TOOL\SCHEMATICS_PARTS\MS_DISCRETE_Library.schlib; MECHANICAL 3D STEP FILE: CAP0201_0-5; Chkd/date: MANIRAJA/011018; Crtd /date: MANIRAJA/011018; Datasheet: Y:\MIS_DATABASE\DATASHEETS\CAPACITORS\MURATA-GCM-SER.PDF; Temperature: -55°C+125°C; Weight: NA; Height: 0.33MM; Library Ref: CAP; Distributor_part_number: NA; Distributor_name: NA; Tolerance: 10%; Mfr_name: MURATA; Footprint Ref: CAP0201_0-5
C518 = CAP_Dup1: CAP CERAMIC 0.1uF 6.3V 10% X7S AUTO 0201; Part Reference: C518; Manufacturer: MURATA; Part_type: CAPACITORS\CERAMIC; Mfr_part_number: GCM033C70J104KE02D; Mistral Part No: 120018100001-R; Custom_Duty: 15%; Customs_HS_Code: 85322990; Wattage: NA; Project: TI_J7_SVB-DUT; Value: 0.1uF; PCB Footprint: CAP0201_0-5; Footprint Path: Y:\MIS_DATABASE\Library\ALTIUM_TOOL\PCB_FOOTPRINTS\Altium_Footprint_Lib.PcbLib; Library Path: Y:\MIS_DATABASE\Library\ALTIUM_TOOL\SCHEMATICS_PARTS\MS_DISCRETE_Library.schlib; MECHANICAL 3D STEP FILE: CAP0201_0-5; Chkd/date: MANIRAJA/011018; Crtd /date: MANIRAJA/011018; Datasheet: Y:\MIS_DATABASE\DATASHEETS\CAPACITORS\MURATA-GCM-SER.PDF; Temperature: -55°C+125°C; Weight: NA; Height: 0.33MM; Library Ref: CAP; Distributor_part_number: NA; Distributor_name: NA; Tolerance: 10%; Mfr_name: MURATA; Footprint Ref: CAP0201_0-5
C520 = CAP_Dup1: CAP CERAMIC 0.1uF 6.3V 10% X7S AUTO 0201; Part Reference: C520; Manufacturer: MURATA; Part_type: CAPACITORS\CERAMIC; Mfr_part_number: GCM033C70J104KE02D; Mistral Part No: 120018100001-R; Custom_Duty: 15%; Customs_HS_Code: 85322990; Wattage: NA; Project: TI_J7_SVB-DUT; Value: 0.1uF; PCB Footprint: CAP0201_0-5; Footprint Path: Y:\MIS_DATABASE\Library\ALTIUM_TOOL\PCB_FOOTPRINTS\Altium_Footprint_Lib.PcbLib; Library Path: Y:\MIS_DATABASE\Library\ALTIUM_TOOL\SCHEMATICS_PARTS\MS_DISCRETE_Library.schlib; MECHANICAL 3D STEP FILE: CAP0201_0-5; Chkd/date: MANIRAJA/011018; Crtd /date: MANIRAJA/011018; Datasheet: Y:\MIS_DATABASE\DATASHEETS\CAPACITORS\MURATA-GCM-SER.PDF; Temperature: -55°C+125°C; Weight: NA; Height: 0.33MM; Library Ref: CAP; Distributor_part_number: NA; Distributor_name: NA; Tolerance: 10%; Mfr_name: MURATA; Footprint Ref: CAP0201_0-5
C524 = CAP_Dup1: CAP CERAMIC 22uF 6.3V 20% X7T AUTO 0805; Part Reference: C524; Manufacturer: MURATA; Automotive Alternate_mfr_part_number: CGA4J1X7T0J226M; Automotive Alternate_mfr_name: TDK; Mistral Part No: 120018100065-R; Mfr_part_number: GCM21BD70J226ME36L; Part_type: CAPACITORS\CERAMIC; Project: TI_J7ES_EVM_SOM; Wattage: NA; Customs_HS_Code: 85322990; Custom_Duty: 15%; Value: 22uF; PCB Footprint: CAP0805_1-25; Footprint Ref: CAP0805_1-25; Mfr_name: MURATA; Tolerance: 20%; Distributor_name: MOUSER; Distributor_part_number: 81-GCM21BD70J226ME6L; Library Ref: CAP; Height: 1.25MM; Weight: NA; Temperature: -55°C+125°C; Datasheet: Y:\MIS_DATABASE\DATASHEETS\CAPACITORS\GCM-SERIES.PDF; Crtd /date: ALVY/251018; Chkd/date: MANIRAJA/261018; MECHANICAL 3D STEP FILE: CAP0805_1-25; Library Path: Y:\MIS_DATABASE\Library\ALTIUM_TOOL\SCHEMATICS_PARTS\MS_DISCRETE_Library.schlib; Footprint Path: Y:\MIS_DATABASE\Library\ALTIUM_TOOL\PCB_FOOTPRINTS\Altium_Footprint_Lib.PcbLib
C528 = CAP_Dup1: CAP CERAMIC 0.1uF 6.3V 10% X7S AUTO 0201; Part Reference: C528; Manufacturer: MURATA; Part_type: CAPACITORS\CERAMIC; Mfr_part_number: GCM033C70J104KE02D; Mistral Part No: 120018100001-R; Custom_Duty: 15%; Customs_HS_Code: 85322990; Wattage: NA; Project: TI_J7_SVB-DUT; Value: 0.1uF; PCB Footprint: CAP0201_0-5; Footprint Path: Y:\MIS_DATABASE\Library\ALTIUM_TOOL\PCB_FOOTPRINTS\Altium_Footprint_Lib.PcbLib; Library Path: Y:\MIS_DATABASE\Library\ALTIUM_TOOL\SCHEMATICS_PARTS\MS_DISCRETE_Library.schlib; MECHANICAL 3D STEP FILE: CAP0201_0-5; Chkd/date: MANIRAJA/011018; Crtd /date: MANIRAJA/011018; Datasheet: Y:\MIS_DATABASE\DATASHEETS\CAPACITORS\MURATA-GCM-SER.PDF; Temperature: -55°C+125°C; Weight: NA; Height: 0.33MM; Library Ref: CAP; Distributor_part_number: NA; Distributor_name: NA; Tolerance: 10%; Mfr_name: MURATA; Footprint Ref: CAP0201_0-5
C530 = CAP_Dup1: CAP CERAMIC 0.1uF 6.3V 10% X7S AUTO 0201; Part Reference: C530; Manufacturer: MURATA; Part_type: CAPACITORS\CERAMIC; Mfr_part_number: GCM033C70J104KE02D; Mistral Part No: 120018100001-R; Custom_Duty: 15%; Customs_HS_Code: 85322990; Wattage: NA; Project: TI_J7_SVB-DUT; Value: 0.1uF; PCB Footprint: CAP0201_0-5; Footprint Path: Y:\MIS_DATABASE\Library\ALTIUM_TOOL\PCB_FOOTPRINTS\Altium_Footprint_Lib.PcbLib; Library Path: Y:\MIS_DATABASE\Library\ALTIUM_TOOL\SCHEMATICS_PARTS\MS_DISCRETE_Library.schlib; MECHANICAL 3D STEP FILE: CAP0201_0-5; Chkd/date: MANIRAJA/011018; Crtd /date: MANIRAJA/011018; Datasheet: Y:\MIS_DATABASE\DATASHEETS\CAPACITORS\MURATA-GCM-SER.PDF; Temperature: -55°C+125°C; Weight: NA; Height: 0.33MM; Library Ref: CAP; Distributor_part_number: NA; Distributor_name: NA; Tolerance: 10%; Mfr_name: MURATA; Footprint Ref: CAP0201_0-5
C531 = CAP_Dup1: CAP CERAMIC 0.1uF 6.3V 10% X7S AUTO 0201; Part Reference: C531; Manufacturer: MURATA; Mistral Part No: 120018100001-R; Mfr_part_number: GCM033C70J104KE02D; Part_type: CAPACITORS\CERAMIC; Project: TI_J7_SVB-DUT; Wattage: NA; Customs_HS_Code: 85322990; Custom_Duty: 15%; Value: 0.1uF; PCB Footprint: CAP0201_0-5; Footprint Ref: CAP0201_0-5; Mfr_name: MURATA; Tolerance: 10%; Distributor_name: NA; Distributor_part_number: NA; Library Ref: CAP; Height: 0.33MM; Weight: NA; Temperature: -55°C+125°C; Datasheet: Y:\MIS_DATABASE\DATASHEETS\CAPACITORS\MURATA-GCM-SER.PDF; Crtd /date: MANIRAJA/011018; Chkd/date: MANIRAJA/011018; MECHANICAL 3D STEP FILE: CAP0201_0-5; Library Path: Y:\MIS_DATABASE\Library\ALTIUM_TOOL\SCHEMATICS_PARTS\MS_DISCRETE_Library.schlib; Footprint Path: Y:\MIS_DATABASE\Library\ALTIUM_TOOL\PCB_FOOTPRINTS\Altium_Footprint_Lib.PcbLib
C532 = CAP_Dup1: CAP CERAMIC 0.1uF 6.3V 10% X7S AUTO 0201; Part Reference: C532; Manufacturer: MURATA; Part_type: CAPACITORS\CERAMIC; Mfr_part_number: GCM033C70J104KE02D; Mistral Part No: 120018100001-R; Custom_Duty: 15%; Customs_HS_Code: 85322990; Wattage: NA; Project: TI_J7_SVB-DUT; Value: 0.1uF; PCB Footprint: CAP0201_0-5; Footprint Path: Y:\MIS_DATABASE\Library\ALTIUM_TOOL\PCB_FOOTPRINTS\Altium_Footprint_Lib.PcbLib; Library Path: Y:\MIS_DATABASE\Library\ALTIUM_TOOL\SCHEMATICS_PARTS\MS_DISCRETE_Library.schlib; MECHANICAL 3D STEP FILE: CAP0201_0-5; Chkd/date: MANIRAJA/011018; Crtd /date: MANIRAJA/011018; Datasheet: Y:\MIS_DATABASE\DATASHEETS\CAPACITORS\MURATA-GCM-SER.PDF; Temperature: -55°C+125°C; Weight: NA; Height: 0.33MM; Library Ref: CAP; Distributor_part_number: NA; Distributor_name: NA; Tolerance: 10%; Mfr_name: MURATA; Footprint Ref: CAP0201_0-5
C536 = CAP_Dup1: CAP CERAMIC 0.1uF 6.3V 10% X7S AUTO 0201; Part Reference: C536; Manufacturer: MURATA; Part_type: CAPACITORS\CERAMIC; Mfr_part_number: GCM033C70J104KE02D; Mistral Part No: 120018100001-R; Custom_Duty: 15%; Customs_HS_Code: 85322990; Wattage: NA; Project: TI_J7_SVB-DUT; Value: 0.1uF; PCB Footprint: CAP0201_0-5; Footprint Path: Y:\MIS_DATABASE\Library\ALTIUM_TOOL\PCB_FOOTPRINTS\Altium_Footprint_Lib.PcbLib; Library Path: Y:\MIS_DATABASE\Library\ALTIUM_TOOL\SCHEMATICS_PARTS\MS_DISCRETE_Library.schlib; MECHANICAL 3D STEP FILE: CAP0201_0-5; Chkd/date: MANIRAJA/011018; Crtd /date: MANIRAJA/011018; Datasheet: Y:\MIS_DATABASE\DATASHEETS\CAPACITORS\MURATA-GCM-SER.PDF; Temperature: -55°C+125°C; Weight: NA; Height: 0.33MM; Library Ref: CAP; Distributor_part_number: NA; Distributor_name: NA; Tolerance: 10%; Mfr_name: MURATA; Footprint Ref: CAP0201_0-5
C537 = CAP_Dup1: CAP CERAMIC 0.1uF 6.3V 10% X7S AUTO 0201; Part Reference: C537; Manufacturer: MURATA; Part_type: CAPACITORS\CERAMIC; Mfr_part_number: GCM033C70J104KE02D; Mistral Part No: 120018100001-R; Custom_Duty: 15%; Customs_HS_Code: 85322990; Wattage: NA; Project: TI_J7_SVB-DUT; Value: 0.1uF; PCB Footprint: CAP0201_0-5; Footprint Path: Y:\MIS_DATABASE\Library\ALTIUM_TOOL\PCB_FOOTPRINTS\Altium_Footprint_Lib.PcbLib; Library Path: Y:\MIS_DATABASE\Library\ALTIUM_TOOL\SCHEMATICS_PARTS\MS_DISCRETE_Library.schlib; MECHANICAL 3D STEP FILE: CAP0201_0-5; Chkd/date: MANIRAJA/011018; Crtd /date: MANIRAJA/011018; Datasheet: Y:\MIS_DATABASE\DATASHEETS\CAPACITORS\MURATA-GCM-SER.PDF; Temperature: -55°C+125°C; Weight: NA; Height: 0.33MM; Library Ref: CAP; Distributor_part_number: NA; Distributor_name: NA; Tolerance: 10%; Mfr_name: MURATA; Footprint Ref: CAP0201_0-5
C544 = CAP_Dup1: CAP CERAMIC 0.1uF 6.3V 10% X7S AUTO 0201; Part Reference: C544; Manufacturer: MURATA; Mistral Part No: 120018100001-R; Mfr_part_number: GCM033C70J104KE02D; Part_type: CAPACITORS\CERAMIC; Project: TI_J7_SVB-DUT; Wattage: NA; Customs_HS_Code: 85322990; Custom_Duty: 15%; Value: 0.1uF; PCB Footprint: CAP0201_0-5; Footprint Ref: CAP0201_0-5; Mfr_name: MURATA; Tolerance: 10%; Distributor_name: NA; Distributor_part_number: NA; Library Ref: CAP; Height: 0.33MM; Weight: NA; Temperature: -55°C+125°C; Datasheet: Y:\MIS_DATABASE\DATASHEETS\CAPACITORS\MURATA-GCM-SER.PDF; Crtd /date: MANIRAJA/011018; Chkd/date: MANIRAJA/011018; MECHANICAL 3D STEP FILE: CAP0201_0-5; Library Path: Y:\MIS_DATABASE\Library\ALTIUM_TOOL\SCHEMATICS_PARTS\MS_DISCRETE_Library.schlib; Footprint Path: Y:\MIS_DATABASE\Library\ALTIUM_TOOL\PCB_FOOTPRINTS\Altium_Footprint_Lib.PcbLib
C545 = CAP_Dup1: CAP CERAMIC 0.1uF 6.3V 10% X7S AUTO 0201; Part Reference: C545; Manufacturer: MURATA; Part_type: CAPACITORS\CERAMIC; Mfr_part_number: GCM033C70J104KE02D; Mistral Part No: 120018100001-R; Custom_Duty: 15%; Customs_HS_Code: 85322990; Wattage: NA; Project: TI_J7_SVB-DUT; Value: 0.1uF; PCB Footprint: CAP0201_0-5; Footprint Path: Y:\MIS_DATABASE\Library\ALTIUM_TOOL\PCB_FOOTPRINTS\Altium_Footprint_Lib.PcbLib; Library Path: Y:\MIS_DATABASE\Library\ALTIUM_TOOL\SCHEMATICS_PARTS\MS_DISCRETE_Library.schlib; MECHANICAL 3D STEP FILE: CAP0201_0-5; Chkd/date: MANIRAJA/011018; Crtd /date: MANIRAJA/011018; Datasheet: Y:\MIS_DATABASE\DATASHEETS\CAPACITORS\MURATA-GCM-SER.PDF; Temperature: -55°C+125°C; Weight: NA; Height: 0.33MM; Library Ref: CAP; Distributor_part_number: NA; Distributor_name: NA; Tolerance: 10%; Mfr_name: MURATA; Footprint Ref: CAP0201_0-5
C551 = CAP_Dup1: CAP CERAMIC 0.1uF 6.3V 10% X7S AUTO 0201; Part Reference: C551; Manufacturer: MURATA; Part_type: CAPACITORS\CERAMIC; Mfr_part_number: GCM033C70J104KE02D; Mistral Part No: 120018100001-R; Custom_Duty: 15%; Customs_HS_Code: 85322990; Wattage: NA; Project: TI_J7_SVB-DUT; Value: 0.1uF; PCB Footprint: CAP0201_0-5; Footprint Path: Y:\MIS_DATABASE\Library\ALTIUM_TOOL\PCB_FOOTPRINTS\Altium_Footprint_Lib.PcbLib; Library Path: Y:\MIS_DATABASE\Library\ALTIUM_TOOL\SCHEMATICS_PARTS\MS_DISCRETE_Library.schlib; MECHANICAL 3D STEP FILE: CAP0201_0-5; Chkd/date: MANIRAJA/011018; Crtd /date: MANIRAJA/011018; Datasheet: Y:\MIS_DATABASE\DATASHEETS\CAPACITORS\MURATA-GCM-SER.PDF; Temperature: -55°C+125°C; Weight: NA; Height: 0.33MM; Library Ref: CAP; Distributor_part_number: NA; Distributor_name: NA; Tolerance: 10%; Mfr_name: MURATA; Footprint Ref: CAP0201_0-5
C556 = CAP_Dup1: CAP CERAMIC 0.1uF 6.3V 10% X7S AUTO 0201; Part Reference: C556; Manufacturer: MURATA; Part_type: CAPACITORS\CERAMIC; Mfr_part_number: GCM033C70J104KE02D; Mistral Part No: 120018100001-R; Custom_Duty: 15%; Customs_HS_Code: 85322990; Wattage: NA; Project: TI_J7_SVB-DUT; Value: 0.1uF; PCB Footprint: CAP0201_0-5; Footprint Path: Y:\MIS_DATABASE\Library\ALTIUM_TOOL\PCB_FOOTPRINTS\Altium_Footprint_Lib.PcbLib; Library Path: Y:\MIS_DATABASE\Library\ALTIUM_TOOL\SCHEMATICS_PARTS\MS_DISCRETE_Library.schlib; MECHANICAL 3D STEP FILE: CAP0201_0-5; Chkd/date: MANIRAJA/011018; Crtd /date: MANIRAJA/011018; Datasheet: Y:\MIS_DATABASE\DATASHEETS\CAPACITORS\MURATA-GCM-SER.PDF; Temperature: -55°C+125°C; Weight: NA; Height: 0.33MM; Library Ref: CAP; Distributor_part_number: NA; Distributor_name: NA; Tolerance: 10%; Mfr_name: MURATA; Footprint Ref: CAP0201_0-5
C557 = CAP_Dup1: CAP CERAMIC 0.1uF 6.3V 10% X7S AUTO 0201; Part Reference: C557; Manufacturer: MURATA; Mistral Part No: 120018100001-R; Mfr_part_number: GCM033C70J104KE02D; Part_type: CAPACITORS\CERAMIC; Project: TI_J7_SVB-DUT; Wattage: NA; Customs_HS_Code: 85322990; Custom_Duty: 15%; Value: 0.1uF; PCB Footprint: CAP0201_0-5; Footprint Ref: CAP0201_0-5; Mfr_name: MURATA; Tolerance: 10%; Distributor_name: NA; Distributor_part_number: NA; Library Ref: CAP; Height: 0.33MM; Weight: NA; Temperature: -55°C+125°C; Datasheet: Y:\MIS_DATABASE\DATASHEETS\CAPACITORS\MURATA-GCM-SER.PDF; Crtd /date: MANIRAJA/011018; Chkd/date: MANIRAJA/011018; MECHANICAL 3D STEP FILE: CAP0201_0-5; Library Path: Y:\MIS_DATABASE\Library\ALTIUM_TOOL\SCHEMATICS_PARTS\MS_DISCRETE_Library.schlib; Footprint Path: Y:\MIS_DATABASE\Library\ALTIUM_TOOL\PCB_FOOTPRINTS\Altium_Footprint_Lib.PcbLib
C562 = CAP_Dup1: CAP CERAMIC 0.1uF 6.3V 10% X7S AUTO 0201; Part Reference: C562; Manufacturer: MURATA; Part_type: CAPACITORS\CERAMIC; Mfr_part_number: GCM033C70J104KE02D; Mistral Part No: 120018100001-R; Custom_Duty: 15%; Customs_HS_Code: 85322990; Wattage: NA; Project: TI_J7_SVB-DUT; Value: 0.1uF; PCB Footprint: CAP0201_0-5; Footprint Path: Y:\MIS_DATABASE\Library\ALTIUM_TOOL\PCB_FOOTPRINTS\Altium_Footprint_Lib.PcbLib; Library Path: Y:\MIS_DATABASE\Library\ALTIUM_TOOL\SCHEMATICS_PARTS\MS_DISCRETE_Library.schlib; MECHANICAL 3D STEP FILE: CAP0201_0-5; Chkd/date: MANIRAJA/011018; Crtd /date: MANIRAJA/011018; Datasheet: Y:\MIS_DATABASE\DATASHEETS\CAPACITORS\MURATA-GCM-SER.PDF; Temperature: -55°C+125°C; Weight: NA; Height: 0.33MM; Library Ref: CAP; Distributor_part_number: NA; Distributor_name: NA; Tolerance: 10%; Mfr_name: MURATA; Footprint Ref: CAP0201_0-5